# Altium schematic sheet PassElement.SchDoc
size 558 x 431 mm; SheetNumber: 5; SheetTotal: 8
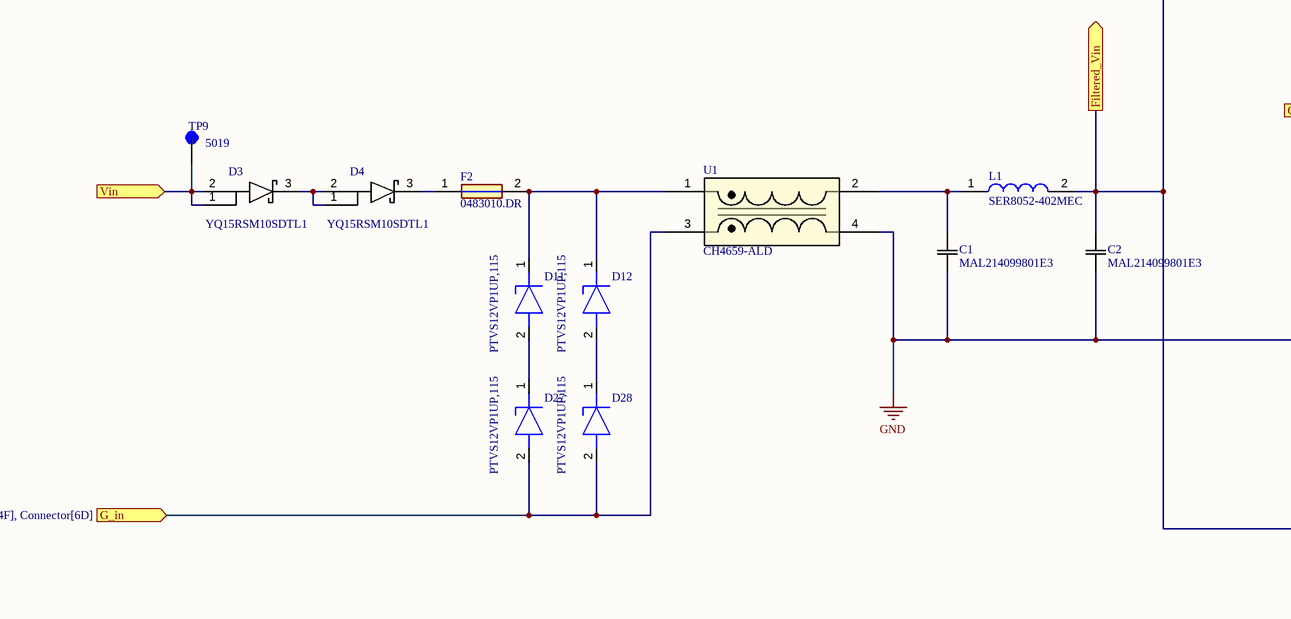
[diagram p0: PassElement.SchDoc, left]
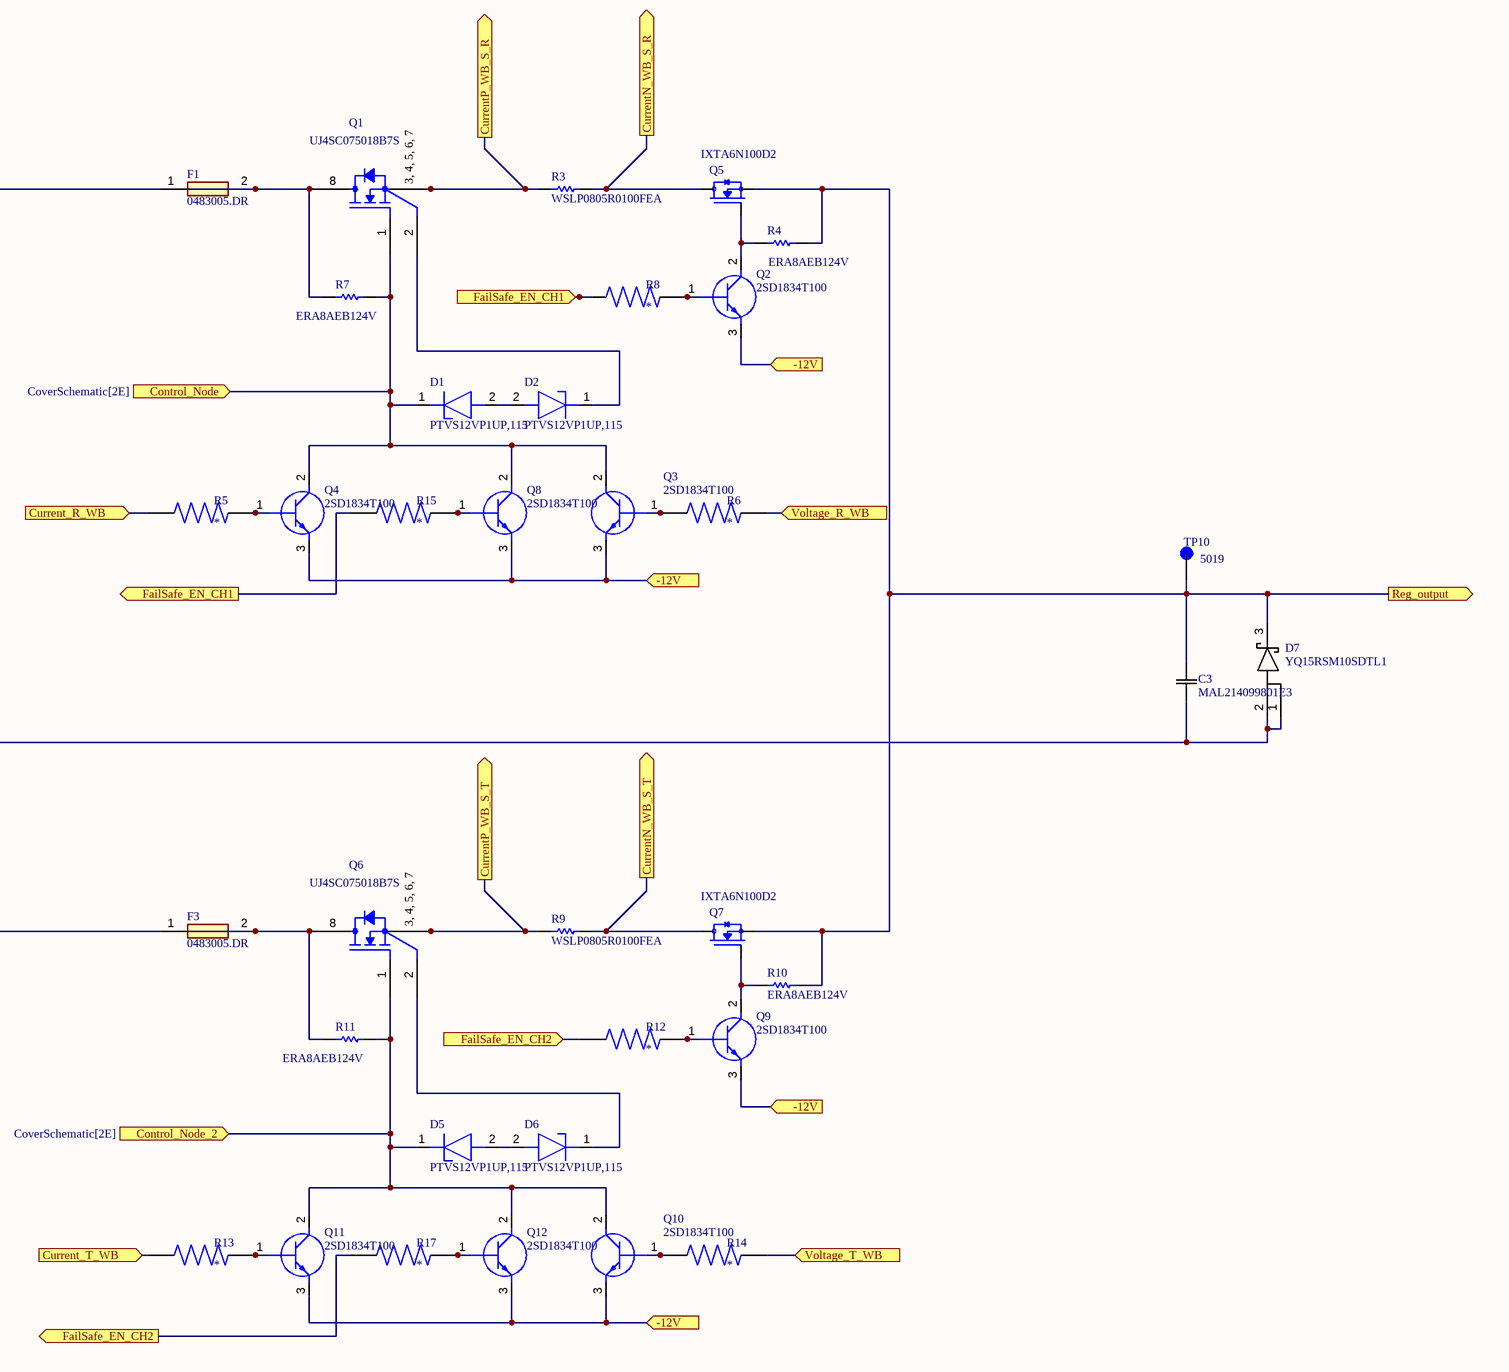
[diagram p1: PassElement.SchDoc, right]

## Parts
C1  MAL214099801E3  [CAP_140CRH_1010_VIS]
C2  MAL214099801E3  [CAP_140CRH_1010_VIS]
C3  MAL214099801E3  [CAP_140CRH_1010_VIS]
D1  PTVS12VP1UP,115  [PMEG3050EP115]
D2  PTVS12VP1UP,115  [PMEG3050EP115]
D3  YQ15RSM10SDTL1  [YQ15RSM10SDTL1]
D4  YQ15RSM10SDTL1  [YQ15RSM10SDTL1]
D5  PTVS12VP1UP,115  [PMEG3050EP115]
D6  PTVS12VP1UP,115  [PMEG3050EP115]
D7  YQ15RSM10SDTL1  [YQ15RSM10SDTL1]
D11  PTVS12VP1UP,115  [PMEG3050EP115]
D12  PTVS12VP1UP,115  [PMEG3050EP115]
D27  PTVS12VP1UP,115  [PMEG3050EP115]
D28  PTVS12VP1UP,115  [PMEG3050EP115]
F1  0483005.DR  [FUSC3316X137N]
F2  0483010.DR  [FUSC3316X137N]
F3  0483005.DR  [FUSC3316X137N]
L1  SER8052-402MEC  [SER8052402MEC]
Q1  UJ4SC075018B7S  [UJ4SC075018B7S]
Q2  2SD1834T100  [RJP020N06]
Q3  2SD1834T100  [RJP020N06]
Q4  2SD1834T100  [RJP020N06]
Q5  IXTA6N100D2  [DPAK254P1524X483-3N]
Q6  UJ4SC075018B7S  [UJ4SC075018B7S]
Q7  IXTA6N100D2  [DPAK254P1524X483-3N]
Q8  2SD1834T100  [RJP020N06]
Q9  2SD1834T100  [RJP020N06]
Q10  2SD1834T100  [RJP020N06]
Q11  2SD1834T100  [RJP020N06]
Q12  2SD1834T100  [RJP020N06]
R3  WSLP0805R0100FEA  [RESC2013X58X38LL25T25]
R4  ERA8AEB124V  [RESC3216X70X50LL20T25]
R5  MCT06030C1001FP500  [RESC1508X55N]  (value not drawn)
R6  MCT06030C1001FP500  [RESC1508X55N]  (value not drawn)
R7  ERA8AEB124V  [RESC3216X70X50LL20T25]
R8  MCT06030C1001FP500  [RESC1508X55N]  (value not drawn)
R9  WSLP0805R0100FEA  [RESC2013X58X38LL25T25]
R10  ERA8AEB124V  [RESC3216X70X50LL20T25]
R11  ERA8AEB124V  [RESC3216X70X50LL20T25]
R12  MCT06030C1001FP500  [RESC1508X55N]  (value not drawn)
R13  MCT06030C1001FP500  [RESC1508X55N]  (value not drawn)
R14  MCT06030C1001FP500  [RESC1508X55N]  (value not drawn)
R15  MCT06030C1001FP500  [RESC1508X55N]  (value not drawn)
R17  MCT06030C1001FP500  [RESC1508X55N]  (value not drawn)
TP9  5019  [KEYSTONE_5019]
TP10  5019  [KEYSTONE_5019]
U1  CH4659-ALD  [CH4659-ALD_COC]

## Ports
-12V (in, see CoverSchematic[3E], Lownoise_auxReg[2C], SolidStateDosimeter[5B], TemperatureMon[3D], TemperatureMon[3E], TemperatureMon[6D]), Control_Node (in, see CoverSchematic[2E]), Control_Node_2 (in, see CoverSchematic[2E]), Current_R_WB (in, see CoverSchematic[4E]), Current_T_WB (in, see CoverSchematic[3E]), CurrentN_WB_S_R (out, see CoverSchematic[4E]), CurrentN_WB_S_T (out, see CoverSchematic[3E], TempEnhanced[8F]), CurrentP_WB_S_R (out, see CoverSchematic[4E]), CurrentP_WB_S_T (out, see CoverSchematic[3E], TempEnhanced[8F]), FailSafe_EN_CH1 (in, see CoverSchematic[4E]), FailSafe_EN_CH1 (out, see CoverSchematic[4E]), FailSafe_EN_CH2 (in, see CoverSchematic[3E]), FailSafe_EN_CH2 (out, see CoverSchematic[3E]), Filtered_Vin (out, see CoverSchematic[3E]), G_in (in, see CoverSchematic[4F], Connector[6D]), Reg_output (out, see CoverSchematic[4F]), Vin (in, see CoverSchematic[4F], Connector[6D]), Voltage_R_WB (in, see CoverSchematic[4E]), Voltage_T_WB (in, see CoverSchematic[3E])

## Nets
GND: C1.1 C2.1 C3.1 D7.1(A1) D7.2(A2) U1.4
-12V: Q2.3(E) Q3.3(E) Q4.3(E) Q8.3(E) Q9.3(E) Q10.3(E) Q11.3(E) Q12.3(E) ; port -12V
Control_Node: D1.1(K) Q1.1 Q3.2(C) Q4.2(C) Q8.2(C) R7.2 ; port Control_Node
Control_Node_2: D5.1(K) Q6.1 Q10.2(C) Q11.2(C) Q12.2(C) R11.2 ; port Control_Node_2
Current_R_WB: R5.1 ; port Current_R_WB
Current_T_WB: R13.1 ; port Current_T_WB
CurrentN_WB_S_R: Q5.4(D) R3.2 ; port CurrentN_WB_S_R
CurrentN_WB_S_T: Q7.4(D) R9.2 ; port CurrentN_WB_S_T
CurrentP_WB_S_R: Q1.3 Q1.4 Q1.5 Q1.6 Q1.7 R3.1 ; port CurrentP_WB_S_R
CurrentP_WB_S_T: Q6.3 Q6.4 Q6.5 Q6.6 Q6.7 R9.1 ; port CurrentP_WB_S_T
FailSafe_EN_CH1: R8.1 R15.1 ; port FailSafe_EN_CH1
FailSafe_EN_CH2: R12.1 R17.1 ; port FailSafe_EN_CH2
Filtered_Vin: C2.2 F1.1 F3.1 L1.2 ; port Filtered_Vin
G_in: D27.2(A) D28.2(A) U1.3 ; port G_in
Reg_output: C3.2 D7.3(K) Q5.3(S) Q7.3(S) R4.2 R10.2 TP10.TP ; port Reg_output
Vin: D3.1(A1) D3.2(A2) TP9.TP ; port Vin
Voltage_R_WB: R6.2 ; port Voltage_R_WB
Voltage_T_WB: R14.2 ; port Voltage_T_WB
NetC1_2: C1.2 L1.1 U1.2
NetD1_2: D1.2(A) D2.2(A)
NetD2_1: D2.1(K) Q1.2
NetD3_3: D3.3(K) D4.1(A1) D4.2(A2)
NetD4_3: D4.3(K) F2.1
NetD5_2: D5.2(A) D6.2(A)
NetD6_1: D6.1(K) Q6.2
NetD11_1: D11.1(K) D12.1(K) F2.2 U1.1
NetD11_2: D11.2(A) D27.1(K)
NetD12_2: D12.2(A) D28.1(K)
NetF1_2: F1.2 Q1.8 R7.1
NetF3_2: F3.2 Q6.8 R11.1
NetQ2_1: Q2.1(B) R8.2
NetQ2_2: Q2.2(C) Q5.1(G) R4.1
NetQ3_1: Q3.1(B) R6.1
NetQ4_1: Q4.1(B) R5.2
NetQ7_1: Q7.1(G) Q9.2(C) R10.1
NetQ8_1: Q8.1(B) R15.2
NetQ9_1: Q9.1(B) R12.2
NetQ10_1: Q10.1(B) R14.1
NetQ11_1: Q11.1(B) R13.2
NetQ12_1: Q12.1(B) R17.2

Not connected (* = marked no-connect by the designer): L1 3

## Notes on the sheet
- DWG. NO.
- REV.
- SHT.
- REVISION
- DESCRIPTION
- DATE
- APPROVED
- THIS DOCUMENT AND THE DATA DISCLOSED HEREIN OR HEREWITH IS THE PROPERTY OF ALTIUM LIMITED AND MAY BE FREELY DISTRIBUTED IN WHOLE. NO RIGHTS ARE RESERVED OR EXPRESS OR IMPLIED WARANTEE GIVEN.
- PROJECT
- TITLE
- SCALE:
- C
- SIZE
- CAGE CODE
- FILE NAME
- DWG by:
- Heitor Sampaio Mendes
- SHEET
- OF
- REV
- (in symbol UJ4SC075018B7S) 3, 4, 5, 6, 7

## Library data of the parts
C1-C3 = MAL214099801E3: No Description Available; Mfr_Name: Vishay
D1 D2 D5 D6 D11 D12 D27 D28 = PTVS12VP1UP,115: Diode ESD (Uni-directional); Manufacturer_Name: Nexperia; Datasheet Link: https://assets.nexperia.com/documents/data-sheet/PTVSXP1UP_SER.pdf; Height: 1mm; Manufacturer_Part_Number: PTVS12VP1UP,115; Mouser Part Number: 771-PTVS12VP1UP115; Mouser Price/Stock: https://www.mouser.co.uk/ProductDetail/Nexperia/PTVS12VP1UP115?qs=5eMHoInnifTeU9%2FVxPGuCA%3D%3D; Arrow Part Number: PTVS12VP1UP,115; Arrow Price/Stock: https://www.arrow.com/en/products/ptvs12vp1up115/nexperia
D3 D4 D7 = YQ15RSM10SDTL1: Schottky Diode; Manufacturer_Name: ROHM Semiconductor; Datasheet Link: https://fscdn.rohm.com/en/products/databook/datasheet/discrete/diode/schottky_barrier/yq15rsm10sdtl1-e.pdf; Height: 1.2mm; Manufacturer_Part_Number: YQ15RSM10SDTL1; Mouser Part Number: 755-YQ15RSM10SDTL1; Mouser Price/Stock: https://www.mouser.co.uk/ProductDetail/ROHM-Semiconductor/YQ15RSM10SDTL1?qs=Z%252BL2brAPG1JP7erh913hZg%3D%3D
F1 F3 = 0483005.DR: Fuse; Manufacturer_Name: LITTELFUSE; Datasheet Link: https://cdn1-originals.webdamdb.com/12956_149052564?cache=1683183235&response-content-disposition=inline;filename=Littelfuse_Fuse_483A.pdf&response-content-type=application/pdf&Policy=eyJTdGF0ZW1lbnQiOlt7IlJlc291cmNlIjoiaHR0cCo6Ly9jZG4xLW9yaWdpbmFscy53ZWJ; Height: 1.371mm; Manufacturer_Part_Number: 0483005.DR; Mouser Part Number: 576-0483005.DR; Mouser Price/Stock: https://www.mouser.co.uk/ProductDetail/Littelfuse/0483005.DR?qs=%252BEew9%252B0nqrAp%252B2CptGC9xg%3D%3D
F2 = 0483010.DR: Fuse; Manufacturer_Name: LITTELFUSE; Datasheet Link: https://www.littelfuse.com/media?resourcetype=datasheets&itemid=c0438919-6934-484b-af98-072ed2079425&filename=littelfuse-fuse-483a; Height: 1.371mm; Manufacturer_Part_Number: 0483010.DR
L1 = SER8052-402MEC: Inductor; Manufacturer_Name: COILCRAFT; Datasheet Link: https://www.coilcraft.com/getmedia/f704c02a-b3a0-4aab-a2f9-03662c81c40d/ser80xx.pdf; Height: 5.2mm; Manufacturer_Part_Number: SER8052-402MEC; Mouser Part Number: 994-SER8052-402MEC; Mouser Price/Stock: https://www.mouser.co.uk/ProductDetail/Coilcraft/SER8052-402MEC?qs=mBwMfv9Clf3lT8OdMPOqNQ%3D%3D
Q1 Q6 = UJ4SC075018B7S: MOSFET 750V/18mO,SICFET,G4,TO263-7; ComponentLink1Description: New link; ComponentLink1URL: *
Q2-Q4 Q8-Q12 = 2SD1834T100: Transistor BJT NPN; Manufacturer_Name: ROHM Semiconductor; Datasheet Link: https://fscdn.rohm.com/en/products/databook/datasheet/discrete/transistor/bipolar/2sd1834t100-e.pdf; Height: 1.45mm; Manufacturer_Part_Number: 2SD1834T100; Mouser Part Number: 755-2SD1834T100; Mouser Price/Stock: https://www.mouser.co.uk/ProductDetail/ROHM-Semiconductor/2SD1834T100?qs=4kLU8WoGk0vMh1jN%252BYQmXQ%3D%3D
Q5 Q7 = IXTA6N100D2: N-Channel 1000 V 6 A 2.2 Ohm SMT Depletion Mode Power Mosfet - D2PAK; MF: {'manufacturer': u'IXYS'}; Package: None; Price: None; Value: *; MP: IXTA6N100D2; Availability: Unavailable
R3 R9 = CMP-2001-04321-1: Manufacturer: Vishay Dale; Part Number: WSLP0805R0100FEA
R4 R7 R10 R11 = CMP-2003-04417-1: Manufacturer: Panasonic; Part Number: ERA8AEB124V
R5 R6 R8 R12-R15 R17 = MCT06030C1001FP500: Res Thin Film 0603 1K Ohm 1% 0.1W(1/10W) ?50ppm/C Molded SMD Automotive Medical T/R; MF: {'manufacturer': u'Vishay Beyschlag'}; Value: *; Package: None; Price: None; MP: MCT06030C1001FP500; Availability: Unavailable
TP9 TP10 = 5019: MF: {'manufacturer': u'Keystone Electronics'}; Package: None; Price: None; Value: *; MP: 5019; Availability: Unavailable
U1 = CH4659-ALD: No Description Available; Mfr_Name: Coilcraft; RefDes: RefDes; Type: Type